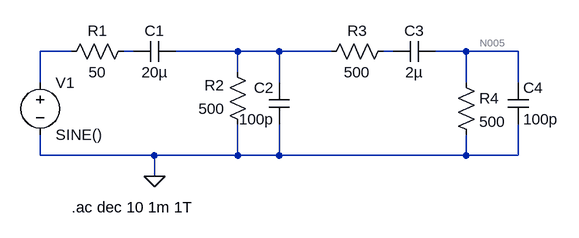
[diagram p0: schematic Part2(B).asc]
Part2(B).asc, the LTspice schematic file:
Version 4
SHEET 1 880 680
WIRE 96 240 48 240
WIRE 192 240 176 240
WIRE 352 240 256 240
WIRE 416 240 352 240
WIRE 496 240 416 240
WIRE 592 240 576 240
WIRE 704 240 656 240
WIRE 784 240 704 240
WIRE 352 272 352 240
WIRE 48 288 48 240
WIRE 416 288 416 240
WIRE 704 288 704 240
WIRE 784 288 784 240
WIRE 48 400 48 368
WIRE 224 400 48 400
WIRE 352 400 352 352
WIRE 352 400 224 400
WIRE 416 400 416 352
WIRE 416 400 352 400
WIRE 704 400 704 368
WIRE 704 400 416 400
WIRE 784 400 784 352
WIRE 784 400 704 400
WIRE 224 432 224 400
FLAG 224 432 0
SYMBOL res 192 224 R90
WINDOW 0 0 56 VBottom 2
WINDOW 3 32 56 VTop 2
SYMATTR InstName R1
SYMATTR Value 50
SYMBOL res 368 368 R180
WINDOW 0 36 76 Left 2
WINDOW 3 36 40 Left 2
SYMATTR InstName R2
SYMATTR Value 500
SYMBOL res 480 256 R270
WINDOW 0 32 56 VTop 2
WINDOW 3 0 56 VBottom 2
SYMATTR InstName R3
SYMATTR Value 500
SYMBOL res 688 272 R0
SYMATTR InstName R4
SYMATTR Value 500
SYMBOL cap 256 224 R90
WINDOW 0 0 32 VBottom 2
WINDOW 3 32 32 VTop 2
SYMATTR InstName C1
SYMATTR Value 20µ
SYMBOL cap 432 352 R180
WINDOW 0 24 56 Left 2
WINDOW 3 24 8 Left 2
SYMATTR InstName C2
SYMATTR Value 100p
SYMBOL cap 592 256 R270
WINDOW 0 32 32 VTop 2
WINDOW 3 0 32 VBottom 2
SYMATTR InstName C3
SYMATTR Value 2µ
SYMBOL cap 768 288 R0
SYMATTR InstName C4
SYMATTR Value 100p
SYMBOL voltage 48 272 R0
SYMATTR InstName V1
SYMATTR Value SINE()
SYMATTR Value2 AC 1
TEXT 96 480 Left 2 !.ac dec 10 1m 1T

The netlist it stands for:
* Part2(B).asc
R1 N002 N001 50
R2 0 N003 500
R3 N003 N004 500
R4 N005 0 500
C1 N003 N002 20µ
C2 0 N003 100p
C3 N004 N005 2µ
C4 N005 0 100p
V1 N001 0 SINE() AC 1
.ac dec 10 1m 1T
.backanno
.end

* Results of the author's LTspice run, read from the files saved beside the schematic
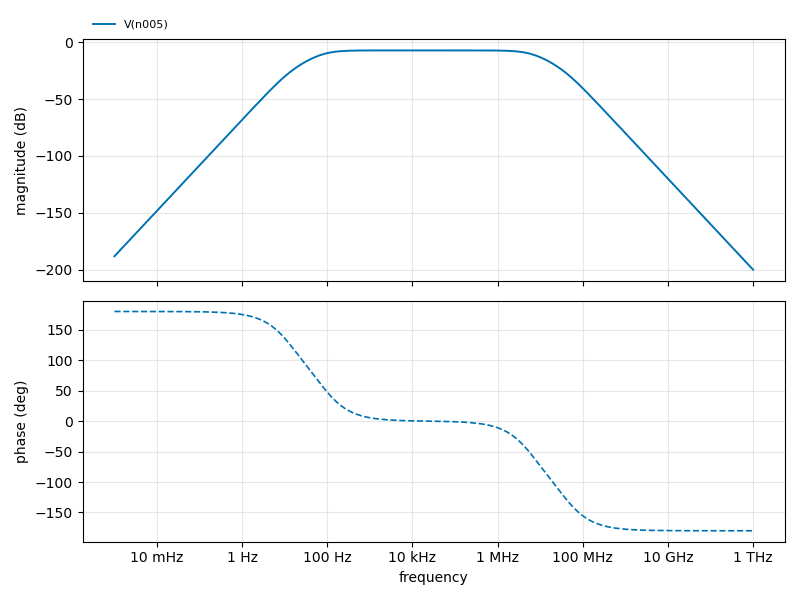
[diagram p1: AC Analysis of Part2(B).asc, plotted from the saved traces]
* AC Analysis, 1 run:
*   V(n005): -188.07 dB at 1 mHz, -199.89 dB at 1 THz, peak -7.23 dB at 25.12 kHz, 3 dB below the peak at 86.27 Hz and 5.875 MHz